# Altium schematic sheet Driver_Board.SchDoc
size A4; SheetNumber: 2; SheetTotal: 2
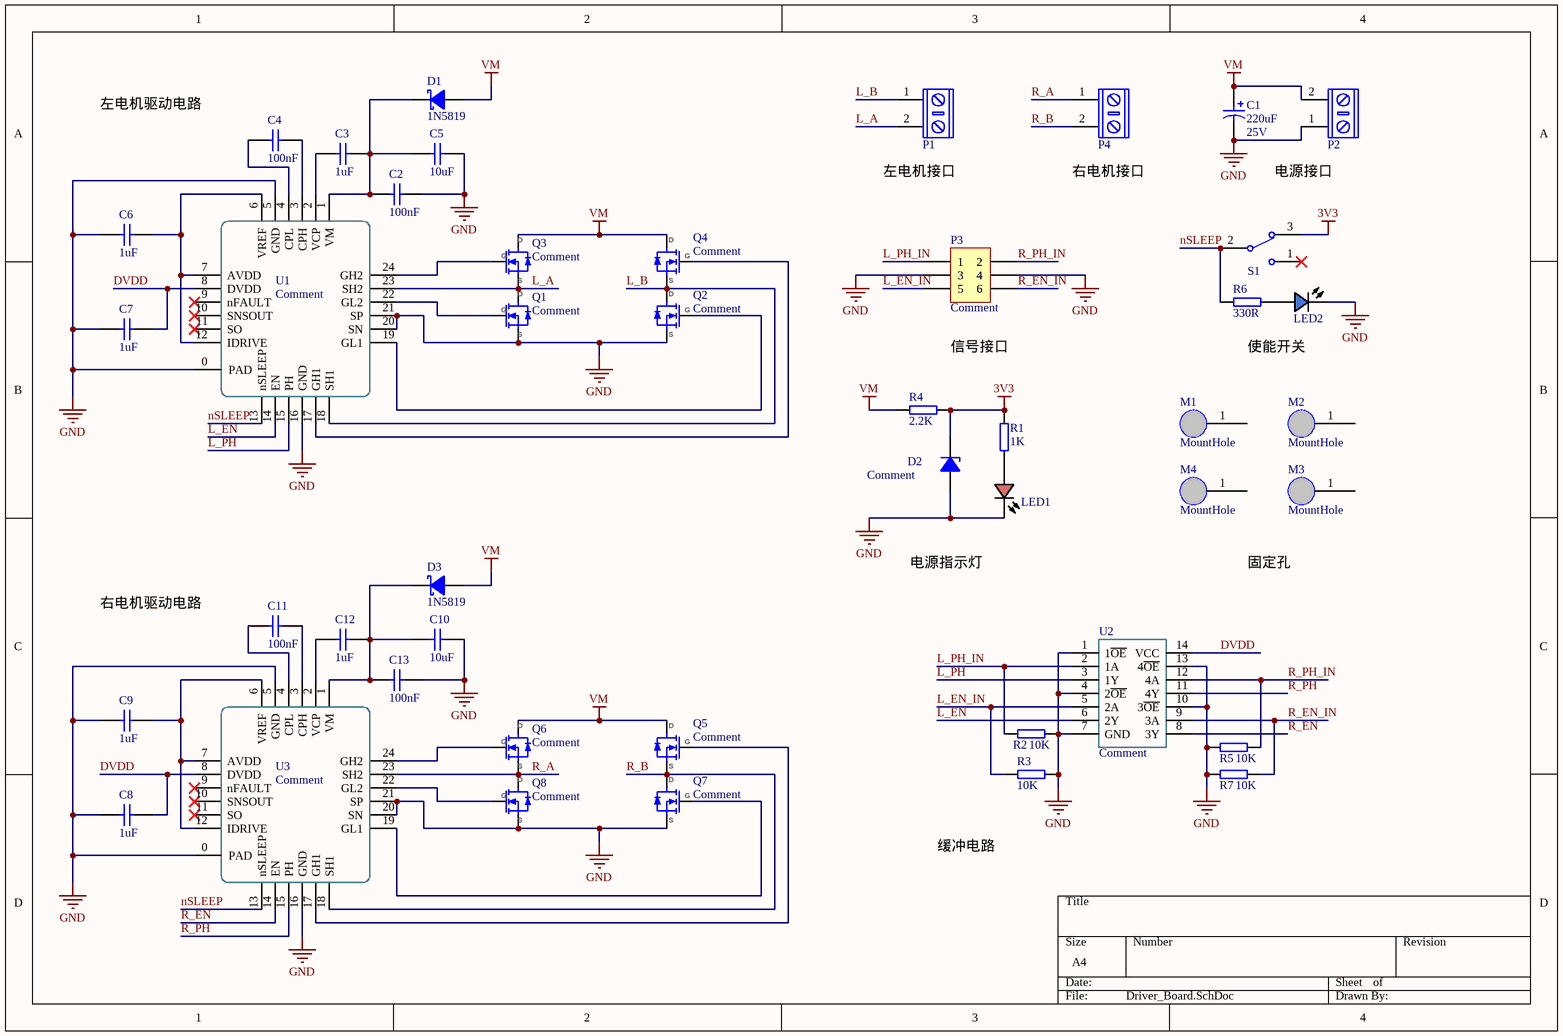
[diagram p0: Driver_Board.SchDoc]

## Parts
C1  value 220uF  Voltage: 25V  [CAPPR3.5-8X11.5]  (hidden comment: Comment)
C2  value 100nF  [0805C]  (hidden comment: Comment)
C3  value 1uF  [0805]  (hidden comment: Comment)
C4  value 100nF  [0805C]  (hidden comment: Comment)
C5  value 10uF  [0805]  (hidden comment: Comment)
C6  value 1uF  [0805]  (hidden comment: Comment)
C7  value 1uF  [0805]  (hidden comment: Comment)
C8  value 1uF  [0805]  (hidden comment: Comment)
C9  value 1uF  [0805]  (hidden comment: Comment)
C10  value 10uF  [0805]  (hidden comment: Comment)
C11  value 100nF  [0805C]  (hidden comment: Comment)
C12  value 1uF  [0805]  (hidden comment: Comment)
C13  value 100nF  [0805C]  (hidden comment: Comment)
D1  PartNumber: 1N5819  [SOD-123-L]  (hidden comment: Comment)
D2  Comment  [SOD-123-L]
D3  PartNumber: 1N5819  [SOD-123-L]  (hidden comment: Comment)
LED1  Comment  [LEDC1608(0805)]  (value not drawn)
LED2  Comment  [LEDC1608(0603)]  (value not drawn)
M1  MountHole  [M3-MountSlot]  (no BOM)
M2  MountHole  [M3-MountSlot]  (no BOM)
M3  MountHole  [M3-MountSlot]  (no BOM)
M4  MountHole  [M3-MountSlot]  (no BOM)
P1  KF/WJ/DG 30x connecter  [KF/WJ/DG 301-2p-5.0mm]  (value not drawn)
P2  KF/WJ/DG 30x connecter  [KF/WJ/DG 301-2p-5.0mm]  (value not drawn)
P3  Comment  [HDR2X3]
P4  KF/WJ/DG 30x connecter  [KF/WJ/DG 301-2p-5.0mm]  (value not drawn)
Q1  Comment  [DFN5x6]
Q2  Comment  [DFN5x6]
Q3  Comment  [DFN5x6]
Q4  Comment  [DFN5x6]
Q5  Comment  [DFN5x6]
Q6  Comment  [DFN5x6]
Q7  Comment  [DFN5x6]
Q8  Comment  [DFN5x6]
R1  value 1K  [RESC1608[0603]S-N]  (hidden comment: Comment)
R2  value 10K  [RESC1608[0603]S-N]  (hidden comment: Comment)
R3  value 10K  [RESC1608[0603]S-N]  (hidden comment: Comment)
R4  value 2.2K  [RESC1608[0603]S-N]  (hidden comment: Comment)
R5  value 10K  [RESC1608[0603]S-N]  (hidden comment: Comment)
R6  value 330R  [RESC1608[0603]S-N]  (hidden comment: Comment)
R7  value 10K  [RESC1608[0603]S-N]  (hidden comment: Comment)
S1  Comment  [SS12D10]  (value not drawn)
U1  Comment  [QFN24-4x4]
U2  Comment  [SOP14-1]
U3  Comment  [SOP14-1]

## Nets
3V3: D2.K R1.2 R4.2 S1.3
GND: C1.2 C2.2 C5.2 C6.1 C7.1 C8.1 C9.1 C10.2 C13.2 D2.A LED1.C LED2.C P2.1 P3.3 P3.4 Q1.3(S) Q2.3(S) Q7.3(S) Q8.3(S) R2.2 R3.2 R5.1 R7.1 U1.0(PAD) U1.5(GND) U1.16(GND) U1.20(SN) U1.21(SP) U2.1(1~{OE}) U2.4(2~{OE}) U2.7(GND) U2.10(3~{OE}) U2.13(4~{OE}) U3.0(PAD) U3.5(GND) U3.16(GND) U3.20(SN) U3.21(SP)
VM: C1.1 D1.A D3.A P2.2 Q3.1(D) Q4.1(D) Q5.1(D) Q6.1(D) R4.1
DVDD: C7.2 C8.2 U1.8(DVDD) U2.14(VCC) U3.8(DVDD)
L_A: P1.2 Q1.1(D) Q3.3(S) U1.23(SH2)
L_B: P1.1 Q2.1(D) Q4.3(S) U1.18(SH1)
L_EN: U1.14(EN) U2.6(2Y)
L_EN_IN: P3.5 R3.1 U2.5(2A)
L_PH: U1.15(PH) U2.3(1Y)
L_PH_IN: P3.1 R2.1 U2.2(1A)
nSLEEP: R6.1 S1.2 U1.13(nSLEEP) U3.13(nSLEEP)
R_A: P4.1 Q6.3(S) Q8.1(D) U3.23(SH2)
R_B: P4.2 Q5.3(S) Q7.1(D) U3.18(SH1)
R_EN: U2.8(3Y) U3.14(EN)
R_EN_IN: P3.6 R7.2 U2.9(3A)
R_PH: U2.11(4Y) U3.15(PH)
R_PH_IN: P3.2 R5.2 U2.12(4A)
NetC2_1: C2.1 C3.2 C5.1 D1.K U1.1(VM)
NetC3_1: C3.1 U1.2(VCP)
NetC4_1: C4.1 U1.4(CPL)
NetC4_2: C4.2 U1.3(CPH)
NetC6_2: C6.2 U1.6(VREF) U1.7(AVDD) U1.12(IDRIVE)
NetC9_2: C9.2 U3.6(VREF) U3.7(AVDD) U3.12(IDRIVE)
NetC10_1: C10.1 C12.2 C13.1 D3.K U3.1(VM)
NetC11_1: C11.1 U3.4(CPL)
NetC11_2: C11.2 U3.3(CPH)
NetC12_1: C12.1 U3.2(VCP)
NetLED1_A: LED1.A R1.1
NetLED2_A: LED2.A R6.2
NetQ1_2: Q1.2(G) U1.22(GL2)
NetQ2_2: Q2.2(G) U1.19(GL1)
NetQ3_2: Q3.2(G) U1.24(GH2)
NetQ4_2: Q4.2(G) U1.17(GH1)
NetQ5_2: Q5.2(G) U3.17(GH1)
NetQ6_2: Q6.2(G) U3.24(GH2)
NetQ7_2: Q7.2(G) U3.19(GL1)
NetQ8_2: Q8.2(G) U3.22(GL2)

Not connected (* = marked no-connect by the designer): M1 1; M2 1; M3 1; M4 1; S1 1*; U1 9(nFAULT)* 10(SNSOUT)* 11(SO)*; U3 9(nFAULT)* 10(SNSOUT)* 11(SO)*

## Notes on the sheet
- 左电机驱动电路
- (near P1) 左电机接口
- (near P4) 右电机接口
- 电源接口
- 信号接口
- 使能开关
- 电源指示灯
- 固定孔
- 右电机驱动电路
- 缓冲电路

## Library data of the parts
C1 = Cap-Elect: Polarized Capacitor (Radial); Published: 8-Jun-2000; Revision: July-2002: Re-released for DXP Platform.; Publisher: Altium Limited; Price(RMB): 0.000
C2 C4 C11 C13 = Cap-Chip_1: 贴片电容; Voltage: 50V; Tolerance: ±10%; Published: 8-Jun-2000; Revision: July-2002: Re-released for DXP Platform.; Publisher: Altium Limited; Price(RMB): 0.000
C3 C6-C9 C12 = Cap-Chip_2: 贴片电容; Voltage: 25V; Tolerance: ±10%; Published: 8-Jun-2000; Revision: July-2002: Re-released for DXP Platform.; Publisher: Altium Limited; Price(RMB): 0.000
C5 C10 = Cap-Chip: 贴片电容; Voltage: 25V; Tolerance: ±10%; Published: 8-Jun-2000; Revision: July-2002: Re-released for DXP Platform.; Publisher: Altium Limited; Price(RMB): 0.000
D1 D3 = Diode Schottky: 肖特基二极管 Diode; Imax: 500mA; Published: 8-Jun-2000; Revision: July-2002: Re-released for DXP Platform.; Publisher: Altium Limited; Price(RMB): 0.000
D2 = Diode Zen: 3.3V稳压二极管 SOD-123; Published: 8-Jun-2000; Revision: July-2002: Re-released for DXP Platform.; Publisher: Altium Limited; Price(RMB): 0.000
LED1 = LED Chip Red: Typical Chip LED; Published: 8-Jun-2000; Revision: July-2002: Re-released for DXP Platform.; Publisher: Altium Limited; Price(RMB): 0.00
LED2 = LED Chip Blue: Typical Chip LED; Color: Blue; Published: 8-Jun-2000; Revision: July-2002: Re-released for DXP Platform.; Publisher: Altium Limited; Price(RMB): 0.00
M1-M4 = MountHole: 固定孔
P1 P2 P4 = KF/WJ/DG 30x: 接线端子 2Pin
P3 = Header 3X2: Header, 3-Pin, Dual row; LatestRevisionDate: 17-Jul-2002; LatestRevisionNote: Re-released for DXP Platform.; Publisher: Altium Limited; Price(RMB): 0.00
Q1-Q8 = TPH1R403NL: 东芝 N沟 MOS
R1 = Res-Chip_2: 贴片电阻; Tolerance: ±1%; Published: 8-Jun-2000; Revision: July-2002: Re-released for DXP Platform.; Publisher: Altium Limited; Price(RMB): 0.000
R2 R3 R5 R7 = Res-Chip_1: 贴片电阻; Tolerance: ±1%; Published: 8-Jun-2000; Revision: July-2002: Re-released for DXP Platform.; Publisher: Altium Limited; Price(RMB): 0.000
R4 = Res-Chip: 贴片电阻; Tolerance: ±1%; Published: 8-Jun-2000; Revision: July-2002: Re-released for DXP Platform.; Publisher: Altium Limited; Price(RMB): 0.000
R6 = Res-Chip_3: 贴片电阻; Tolerance: ±1%; Published: 8-Jun-2000; Revision: July-2002: Re-released for DXP Platform.; Publisher: Altium Limited; Price(RMB): 0.000
S1 = SW-SPDT: 单刀双掷开关 3脚船型、钮子、拨动开关 SPDT Subminiature Toggle Switch; Published: 24-Mar-1999; Publisher: Altium Limited; Price(RMB): 0.000
U1 U3 = DRV8701E: DRV8701E Ti全桥驱动芯片
U2 = SN74HC125PWR: 三态输出的四路缓冲器 TSSOP-20